# EAGLE design main (EAGLE 6.3)
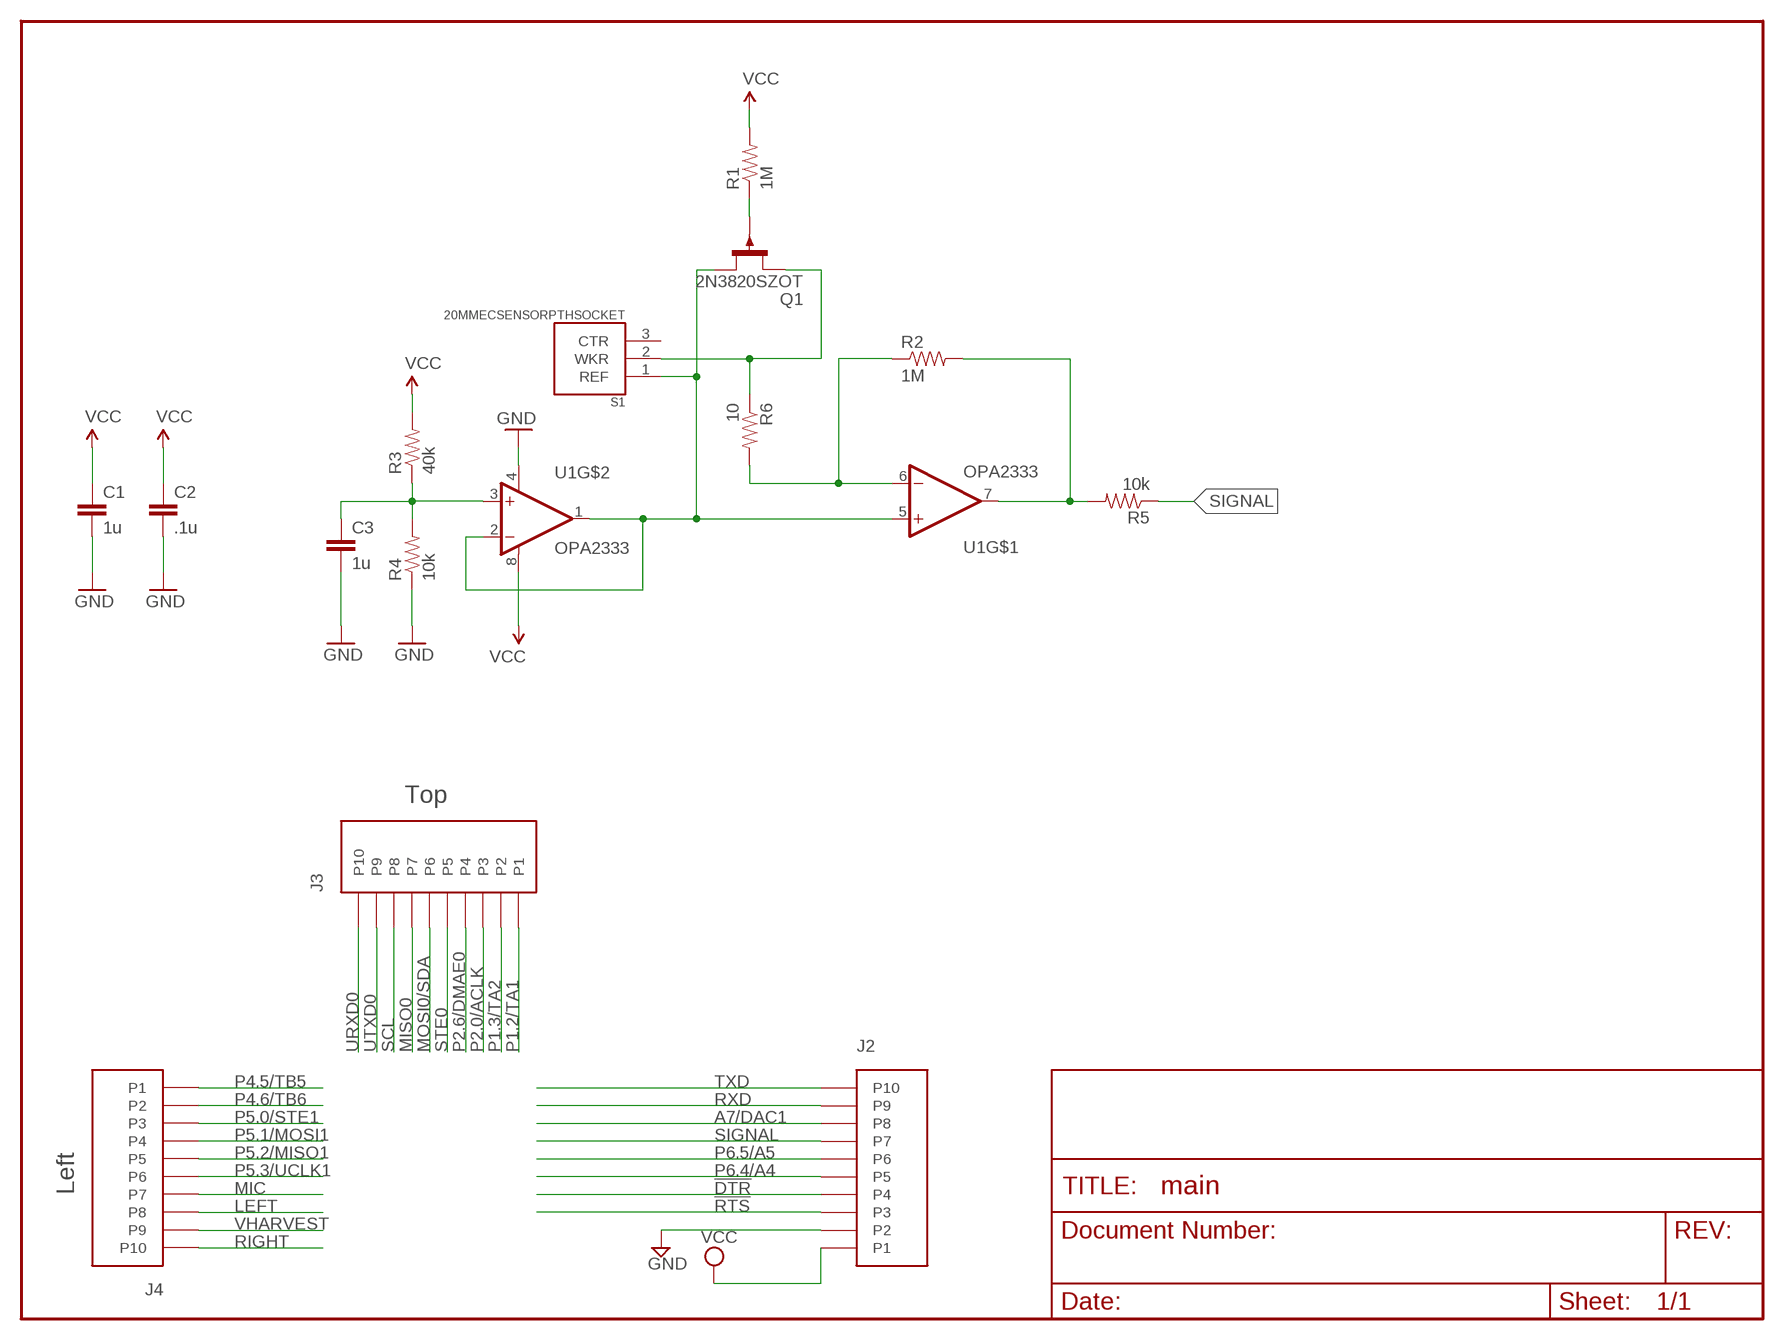
[diagram p0: schematic, sheet 1]

## Parts
C1  1u  CAP0603-CAP  [0603-CAP]
C2  .1u  CAP0603-CAP  [0603-CAP]
C3  1u  CAP0603-CAP  [0603-CAP]
J2  HEADER10POS  [10PIN2MMHEADER]
J3  HEADER10POS  [10PIN2MMHEADER]
J4  HEADER10POS  [10PIN2MMHEADER]
Q1  2N3820SZOT  [SOT23-3]
R1  1M  RESISTOR0603-RES  [0603-RES]
R2  1M  RESISTOR0603-RES  [0603-RES]
R3  40k  RESISTOR0603-RES  [0603-RES]
R4  10k  RESISTOR0603-RES  [0603-RES]
R5  10k  RESISTOR0603-RES  [0603-RES]
R6  10  RESISTOR0603-RES  [0603-RES]
S1  20MMECSENSORPTHSOCKET  [20MMSENSOR]
U1  OPA2333  [SOIC]

## Nets
!DTR: J2.P4
!RTS: J2.P3
A7/DAC1: J2.P8
GND: C1.2 C2.2 C3.2 J2.P2 R4.1 U1.4(V-)
LEFT: J4.P8
MIC: J4.P7
MISO0: J3.P7
MOSI0/SDA: J3.P6
N$1: Q1.1(D) R6.1 S1.2(WKR)
N$2: R2.2 R5.2 U1.7(OUT)
N$3: R2.1 R6.2 U1.6(-IN)
N$5: Q1.3(G) R1.1
P1.2/TA1: J3.P1
P1.3/TA2: J3.P2
P2.0/ACLK: J3.P3
P2.6/DMAE0: J3.P4
P4.5/TB5: J4.P1
P4.6/TB6: J4.P2
P5.0/STE1: J4.P3
P5.1/MOSI1: J4.P4
P5.2/MISO1: J4.P5
P5.3/UCLK1: J4.P6
P6.4/A4: J2.P5
P6.5/A5: J2.P6
RIGHT: J4.P10
RXD: J2.P9
SCL: J3.P8
SIGNAL: J2.P7 R5.1
STE0: J3.P5
TXD: J2.P10
URXD0: J3.P10
UTXD0: J3.P9
VCC: C1.1 C2.1 J2.P1 R1.2 R3.2 U1.8(V+)
VHARVEST: J4.P9
VREF: Q1.2(S) S1.1(REF) U1.1(OUT) U1.2(-IN) U1.5(+IN)
WHATEV: C3.1 R3.1 R4.2 U1.3(+IN)
Unconnected: S1.3(CTR)

## Notes on the sheet
- Top
- Left

## Library data of the parts
C1-C3 = SparkFun:CAP: Capacitor Standard 0603 ceramic capacitor, and 0.1" leaded capacitor.
J2-J4 = hijack:HEADER10POS: Fits 3M 950510-6102-AR
Q1 = new_parts:2N3820: P-CHANNEL FET
R1-R6 = SparkFun:RESISTOR: Resistor Basic schematic elements and footprints for 0603, 1206, and PTH 1/10th watt (small) resistors.
S1 = new_parts:20MMECSENSOR
U1 = androbin:OPA2333

## Board
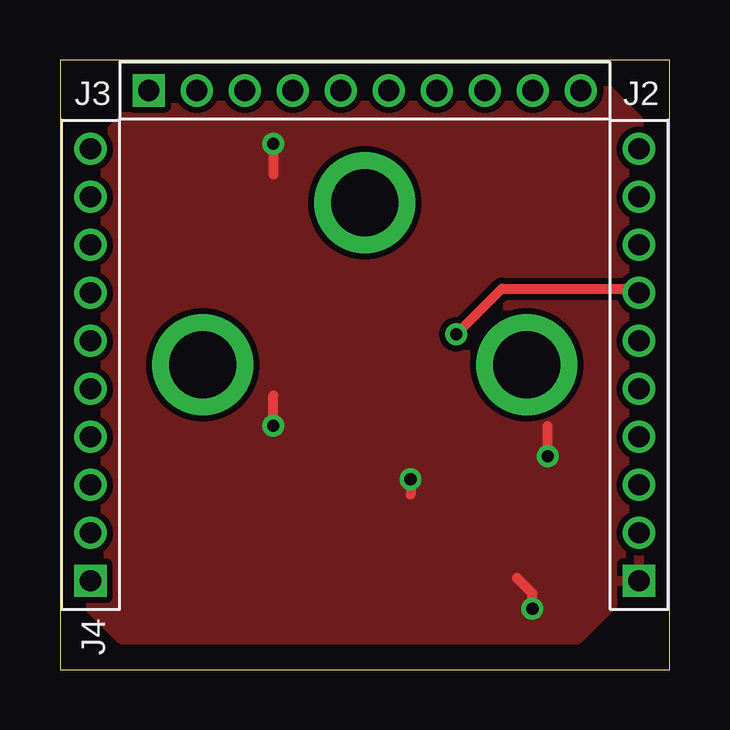
[diagram p1: board, top side]
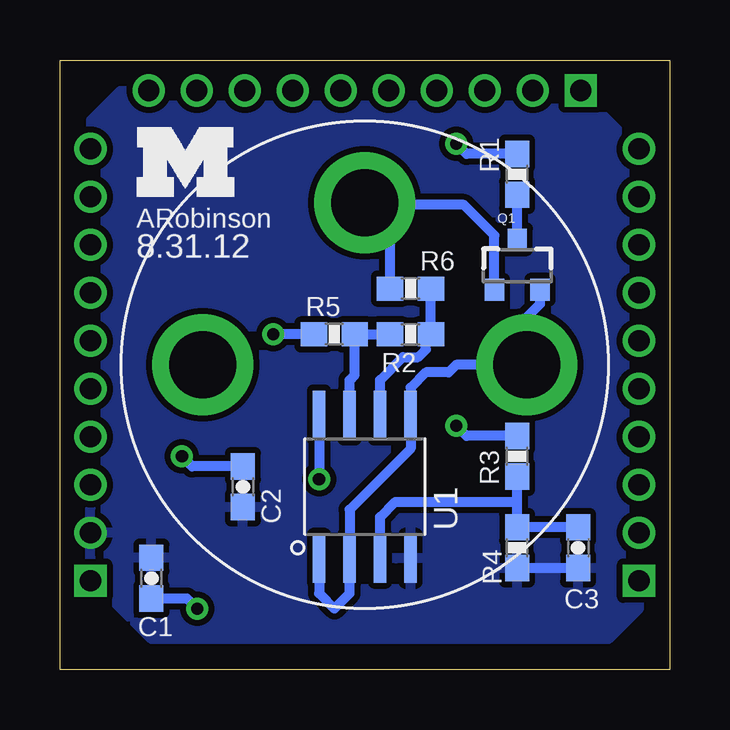
[diagram p2: board, bottom side, seen from below]

Size 25.4 x 25.4 mm. Coordinates in mm from the lower left corner, seen from the top.
Outline: 0,0 25.4,0 25.4,25.4 0,25.4 0,0
Copper layers (1*16): Top 0.0178mm / dielectric 59mil / Bottom 0.0178mm
Design rules "default": minimum track width 6mil, minimum drill 14mil, track to track 6mil, track to pad 6mil, pad to pad 6mil, via to via 6mil, smd to smd 6mil, copper to edge 20mil, drill to drill 16mil, minimum pad ring 8mil, minimum via ring 8mil, stop-mask expansion 3mil, vias tented up to drill 0mil, thermal gap 10mil

### Footprints (pad centres in the part's own frame; a part is rotated, then mirrored left to right if it is on the bottom)
0603-CAP = smd 1.1 x 1: 1 -0.85,0; 2 0.85,0
10PIN2MMHEADER = drill 0.89 pad 1.346 square: P1 -9,0 | drill 0.89 pad 1.346: P2 -7,0; P3 -5,0; P4 -3,0; P5 -1,0; P6 1,0; P7 3,0; P8 5,0; P9 7,0; P10 9,0
SOT23-3 = smd 0.8 x 0.9: 1 -0.95,-1; 2 0.95,-1; 3 0,1.1
0603-RES = smd 1.1 x 1: 1 -0.85,0; 2 0.85,0
20MMSENSOR = drill 2.8: 1 -6.75,0; 2 0,6.75; 3 6.75,0
SOIC = smd 0.51 x 2.032: 1 -1.905,-2.985; 2 -0.635,-2.985; 3 0.635,-2.985; 4 1.905,-2.985; 5 1.905,2.985; 6 0.635,2.985; 7 -0.635,2.985; 8 -1.905,2.985

### Placement (x,y rotation side)
C1  21.59,3.81 90 bottom
C2  17.78,7.62 270 bottom
C3  3.81,5.08 270 bottom
J2  24.13,12.7 90 top
J3  12.7,24.13 0 top
J4  1.27,12.7 90 top
Q1  6.35,16.83 0 bottom
R1  6.35,20.64 90 bottom
R2  10.79,13.97 180 bottom
R3  6.35,8.89 90 bottom
R4  6.35,5.08 90 bottom
R5  13.97,13.97 0 bottom
R6  10.79,15.88 0 bottom
S1  12.7,12.7 0 top
U1  12.7,7.62 0 bottom
U$1  [BLOCK-M]  22.23,19.68 0 bottom

### Tracks (layer width: path | path; a pad name or v marks a point on that pad's centre or on a via)
GND
  Bottom 0.406: C3.2 R4.1
  pour Bottom (isolate 0.254): 3.81,24.13 1.27,21.59 1.27,2.54 2.54,1.27 21.59,1.27 24.13,3.81 24.13,22.86 22.86,24.13
N$1
  Bottom 0.254: Q1.1 7.3,15.87 | 12.62,19.37 S1.2
  Bottom 0.406: R6.1 11.64,17.76 11.82,18.05 S1.2 | Q1.1 7.3,18.09 8.57,19.37 12.62,19.37
N$2
  Bottom 0.406: R2.2 R5.2 13.12,12.28 13.34,12.06 U1.7
N$3
  Bottom 0.406: R6.2 R2.1 10.16,13.76 10.16,13.34 10.48,13.02 11.11,13.02 12.06,12.06 U1.6
N$5
  Bottom 0.406: Q1.3 R1.1
SIGNAL  (via drill 0.51)
  Top 0.406: v16.51,13.97 18.41,15.88 23.95,15.88 J2.P7
  Bottom 0.406: R5.1 v16.51,13.97
VCC  (via drill 0.51)
  Top 0.406: v8.89,21.91 8.89,20.64 | v8.89,10.16 8.89,11.43 | v20.32,8.89 20.32,10.16 | v19.68,2.54 19.68,3.17 19.05,3.81 | v14.61,7.94 14.61,7.3
  Bottom 0.406: R1.2 8.47,21.49 v8.89,21.91 | R3.2 8.47,9.74 v8.89,10.16 | C2.1 19.9,8.47 v20.32,8.89 | C1.1 20.11,2.96 v19.68,2.54 | U1.8 v14.61,7.94
  pour Top (isolate 0.254): 3.81,24.13 1.27,21.59 1.27,2.54 2.54,1.27 21.59,1.27 24.13,3.81 24.13,22.86 22.86,24.13
VREF
  Bottom 0.254: Q1.2
  Bottom 0.406: Q1.2 5.4,15.24 5.95,14.69 S1.1 8.89,12.7 9.21,12.38 10.16,12.38 10.79,11.75 U1.5 10.79,9.21 13.34,6.67 U1.2 13.34,3.17 13.97,2.54 14.61,3.17 U1.1
WHATEV
  Bottom 0.406: C3.1 R4.2 6.35,6.99 | 6.35,6.99 R3.1 | U1.3 12.06,6.35 11.43,6.99 6.35,6.99

### Text on the board
bPlace: ARobinson | 8.31.12